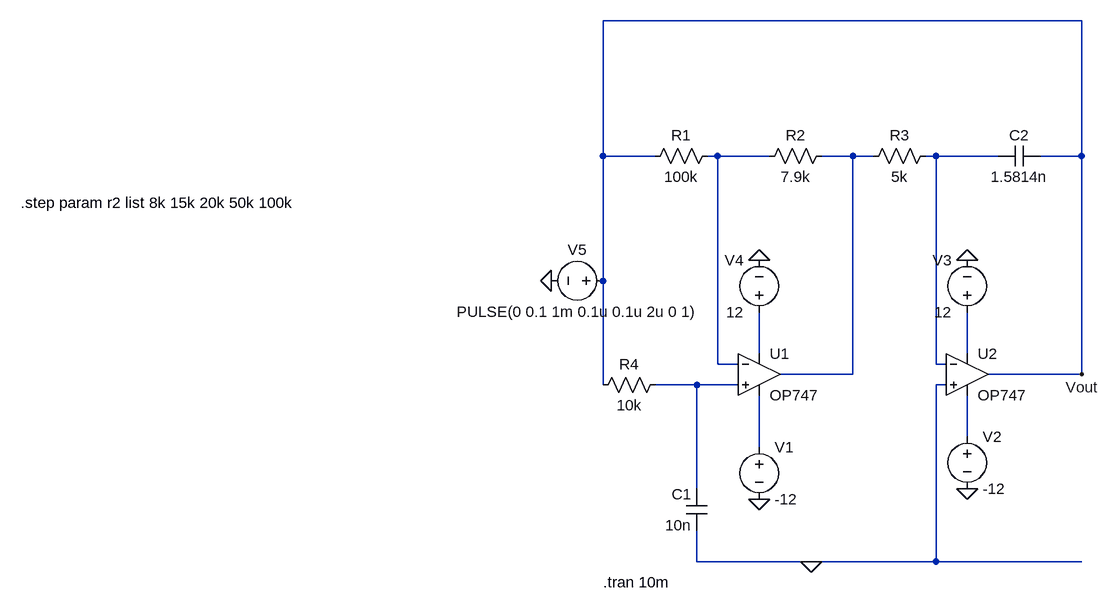
[diagram p0: schematic Draft16.asc]
Draft16.asc, the LTspice schematic file:
Version 4
SHEET 1 880 680
WIRE 688 -384 -48 -384
WIRE -48 -176 -48 -384
WIRE 32 -176 -48 -176
WIRE 128 -176 112 -176
WIRE 208 -176 128 -176
WIRE 336 -176 288 -176
WIRE 368 -176 336 -176
WIRE 464 -176 448 -176
WIRE 560 -176 464 -176
WIRE 688 -176 688 -384
WIRE 688 -176 624 -176
WIRE -48 16 -48 -176
WIRE 192 128 192 64
WIRE 512 128 512 64
WIRE 128 144 128 -176
WIRE 160 144 128 144
WIRE 464 144 464 -176
WIRE 480 144 464 144
WIRE 336 160 336 -176
WIRE 336 160 224 160
WIRE 688 160 688 -176
WIRE 688 160 544 160
WIRE -48 176 -48 16
WIRE 96 176 32 176
WIRE 160 176 96 176
WIRE 480 176 464 176
WIRE 512 256 512 192
WIRE 192 272 192 192
WIRE 96 336 96 176
WIRE 96 448 96 400
WIRE 272 448 96 448
WIRE 464 448 464 176
WIRE 464 448 272 448
WIRE 688 448 464 448
FLAG 272 448 0
FLAG 688 160 Vout
FLAG 192 352 0
FLAG 512 336 0
FLAG 512 -16 0
FLAG 192 -16 0
FLAG -128 16 0
SYMBOL cap 112 400 R180
WINDOW 0 24 56 Left 2
WINDOW 3 24 8 Left 2
SYMATTR InstName C1
SYMATTR Value 10n
SYMBOL res 128 -192 R90
WINDOW 0 0 56 VBottom 2
WINDOW 3 32 56 VTop 2
SYMATTR InstName R1
SYMATTR Value 100k
SYMBOL res 304 -192 R90
WINDOW 0 0 56 VBottom 2
WINDOW 3 32 56 VTop 2
SYMATTR InstName R2
SYMATTR Value 7.9k
SYMBOL OpAmps\\OP747 192 96 R0
SYMATTR InstName U1
SYMBOL OpAmps\\OP747 512 96 R0
SYMATTR InstName U2
SYMBOL cap 624 -192 R90
WINDOW 0 0 32 VBottom 2
WINDOW 3 32 32 VTop 2
SYMATTR InstName C2
SYMATTR Value 1.5814n
SYMBOL res 464 -192 R90
WINDOW 0 0 56 VBottom 2
WINDOW 3 32 56 VTop 2
SYMATTR InstName R3
SYMATTR Value 5k
SYMBOL res 48 160 R90
WINDOW 0 0 56 VBottom 2
WINDOW 3 32 56 VTop 2
SYMATTR InstName R4
SYMATTR Value 10k
SYMBOL voltage 192 256 R0
SYMATTR InstName V1
SYMATTR Value -12
SYMBOL voltage 512 240 R0
SYMATTR InstName V2
SYMATTR Value -12
SYMBOL voltage 512 80 R180
WINDOW 0 24 96 Left 2
WINDOW 3 24 16 Left 2
WINDOW 123 0 0 Left 0
WINDOW 39 0 0 Left 0
SYMATTR InstName V3
SYMATTR Value 12
SYMBOL voltage 192 80 R180
WINDOW 0 24 96 Left 2
WINDOW 3 24 16 Left 2
WINDOW 123 0 0 Left 0
WINDOW 39 0 0 Left 0
SYMATTR InstName V4
SYMATTR Value 12
SYMBOL voltage -32 16 R90
WINDOW 0 -32 56 VBottom 2
WINDOW 3 32 56 VTop 2
WINDOW 123 0 0 Left 0
WINDOW 39 0 0 Left 0
SYMATTR InstName V5
SYMATTR Value PULSE(0 0.1 1m 0.1u 0.1u 2u 0 1)
TEXT -48 480 Left 2 !.tran 10m
TEXT -944 -104 Left 2 !.step param r2 list 8k 15k 20k 50k 100k

The netlist it stands for:
* Draft16.asc
C1 0 N006 10n
R1 N001 Vout 100k
R2 N002 N001 7.9k
XU1 N006 N001 N004 N008 N002 OP747  ; pins In+ In- V+ V- OUT
XU2 0 N003 N005 N007 Vout OP747  ; pins In+ In- V+ V- OUT
C2 Vout N003 1.5814n
R3 N003 N002 5k
R4 N006 Vout 10k
V1 N008 0 -12
V2 N007 0 -12
V3 N005 0 12
V4 N004 0 12
V5 Vout 0 PULSE(0 0.1 1m 0.1u 0.1u 2u 0 1)
.tran 10m
.step param r2 list 8k 15k 20k 50k 100k
.backanno
.end